# Altium schematic sheet PCB_3U_VHDCI_Baseboard.schdoc: Metlino VHDCI
size 420 x 297 mm; Author: G.K.; CompanyName: WUT; DrawnBy: G.K.; Organization: WUT ISE; Address1: Warsaw Univeristy of Technology; Address2: Nowowiejska 15/19; Revision: -; SheetNumber: -; SheetTotal: -; EDA_Number: ARTIQ; Projet: ARTIQ; ModifiedBy: -; CreateDate: XX/XX/XXXX; CheckedDate: -; Title2: Base board; DivGrp: ISE; Designer: G.K.; ModifiedDate: -; ProjectName: ARTIQ
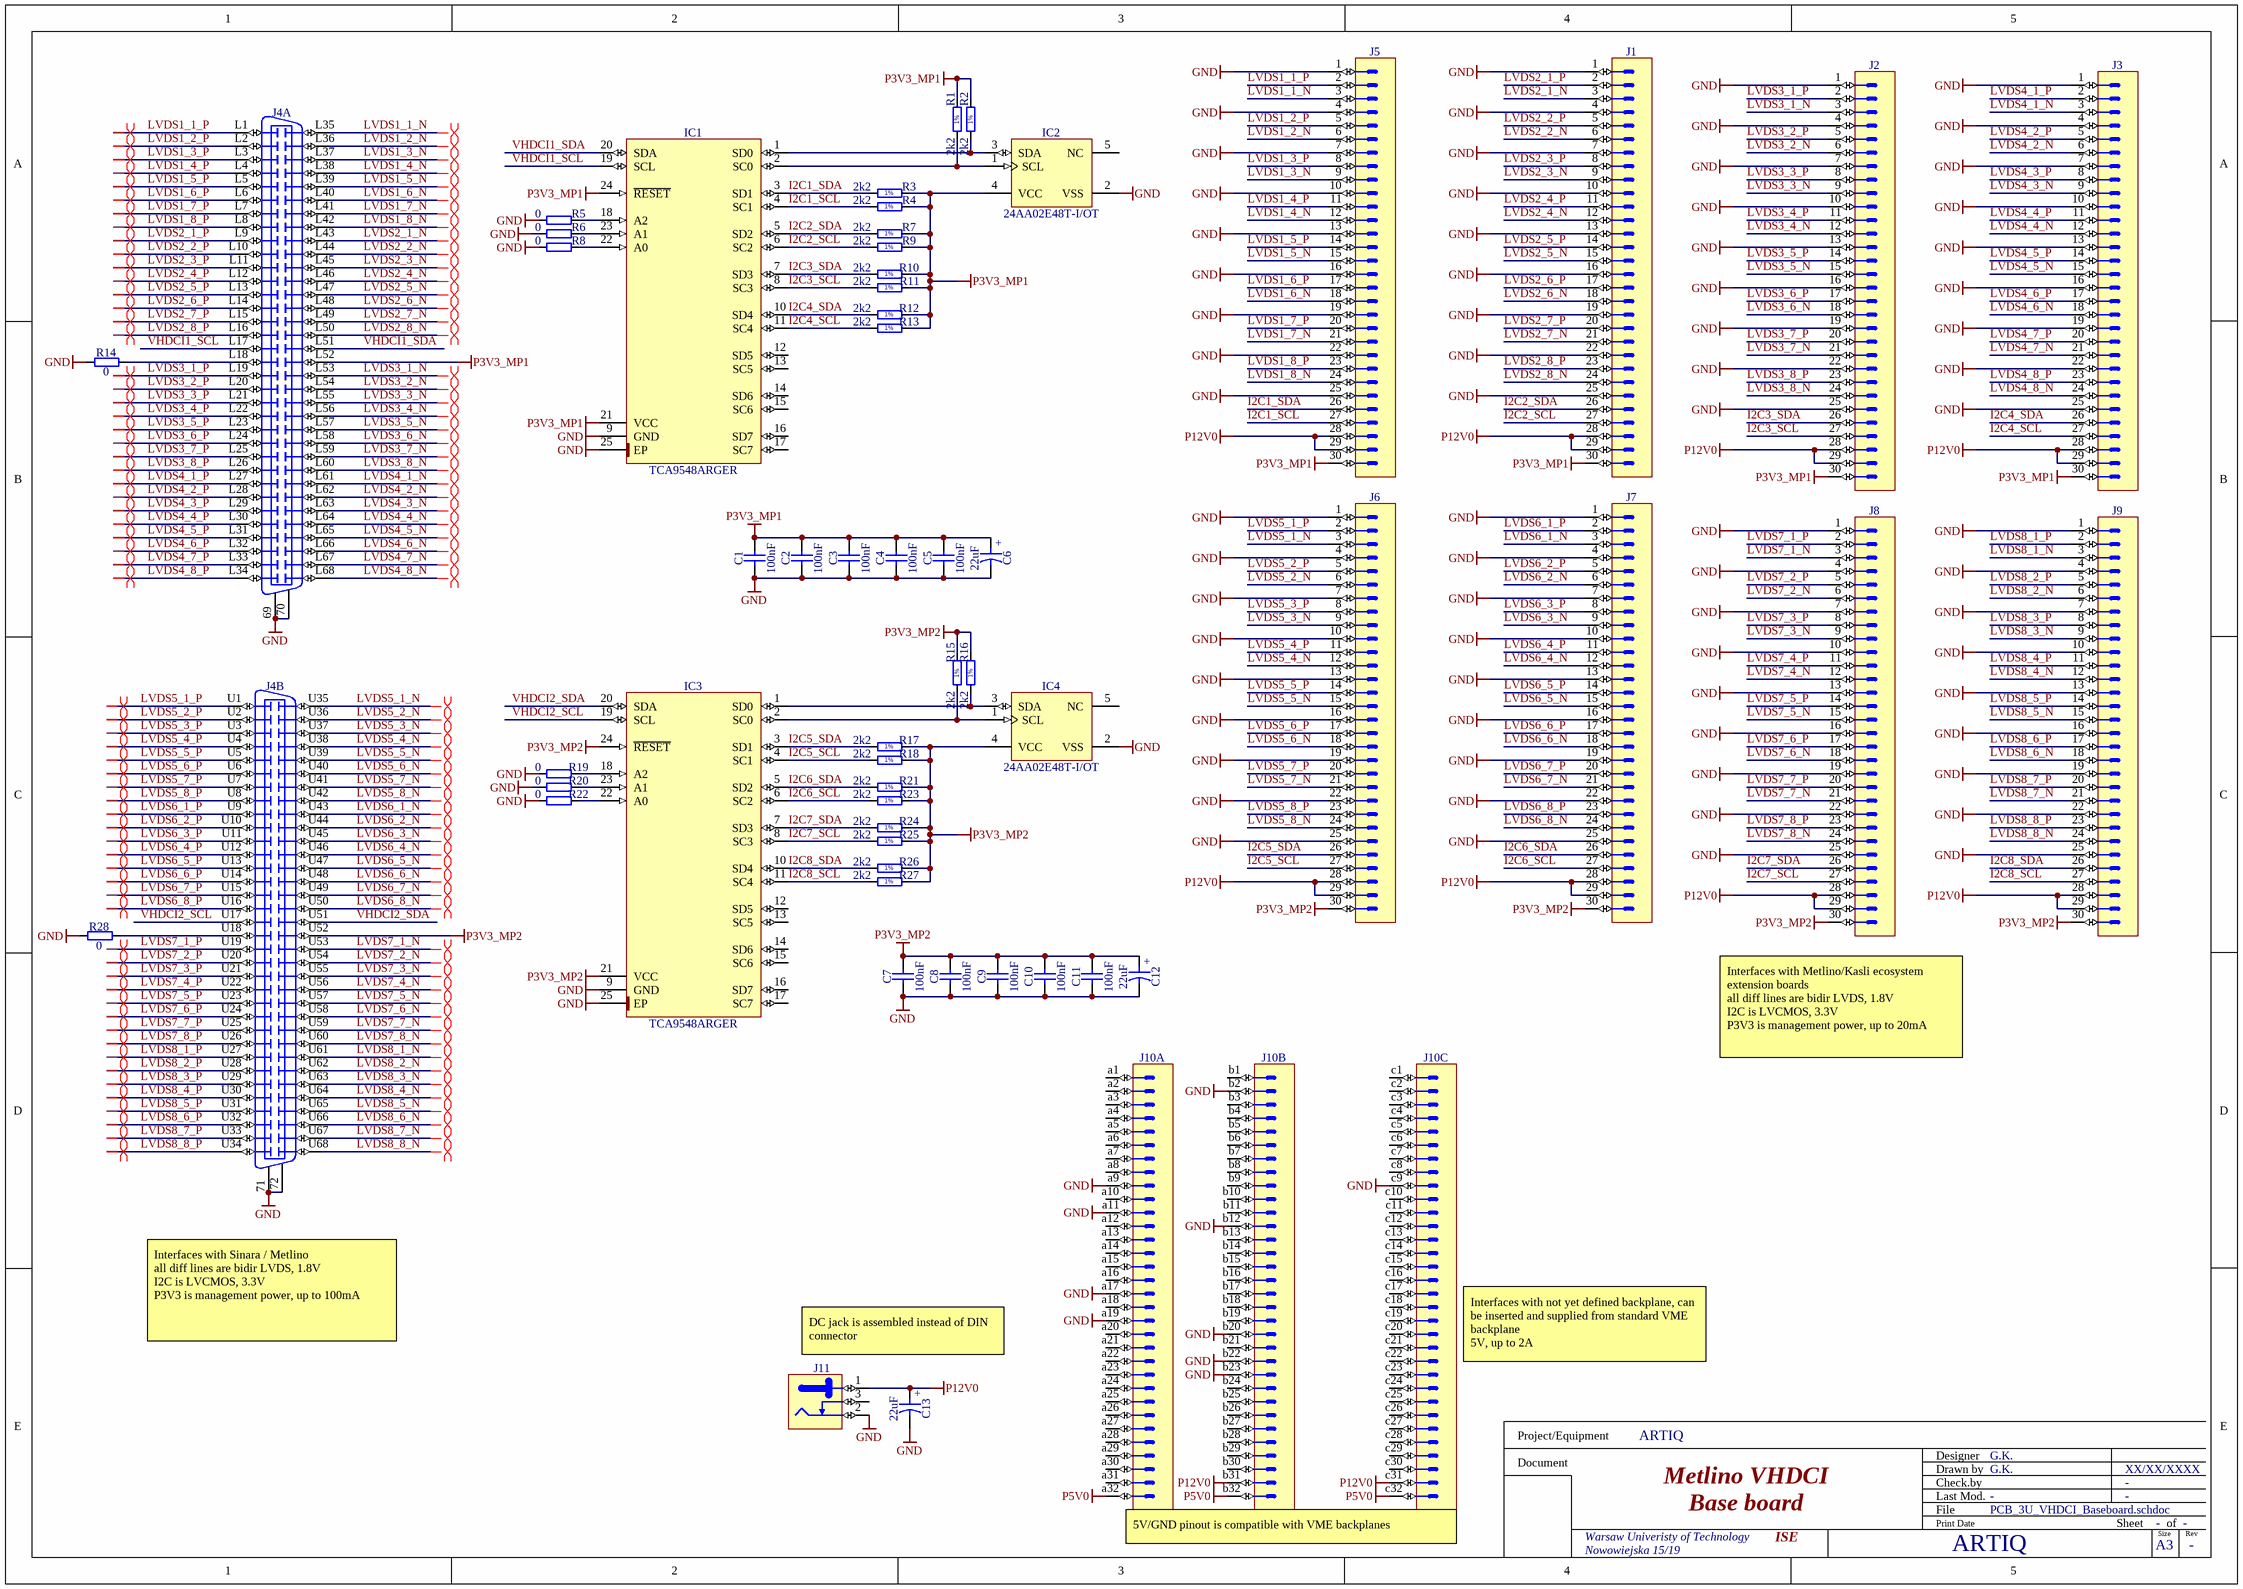
[diagram p0: PCB_3U_VHDCI_Baseboard.schdoc]

## Parts
C1  100nF  [CAPC1005X55N]
C2  100nF  [CAPC1005X55N]
C3  100nF  [CAPC1005X55N]
C4  100nF  [CAPC1005X55N]
C5  100nF  [CAPC1005X55N]
C6  22uF  [CAPAE530X540N]
C7  100nF  [CAPC1005X55N]
C8  100nF  [CAPC1005X55N]
C9  100nF  [CAPC1005X55N]
C10  100nF  [CAPC1005X55N]
C11  100nF  [CAPC1005X55N]
C12  22uF  [CAPAE530X540N]
C13  22uF  [CAPAE530X540N]
IC1  TCA9548ARGER  [QFN50P400X400X100-25N-S220]
IC2  24AA02E48T-I/OT  [SOT95P280X145-5N]
IC3  TCA9548ARGER  [QFN50P400X400X100-25N-S220]
IC4  24AA02E48T-I/OT  [SOT95P280X145-5N]
J1  (no value)  [3M_N2530-6002RB]
J2  (no value)  [3M_N2530-6002RB]
J3  (no value)  [3M_N2530-6002RB]
J4  VHDCI  [MOLEX_74337-0015]  (value not drawn)  (parts A,B of 2)
J5  (no value)  [3M_N2530-6002RB]
J6  (no value)  [3M_N2530-6002RB]
J7  (no value)  [3M_N2530-6002RB]
J8  (no value)  [3M_N2530-6002RB]
J9  (no value)  [3M_N2530-6002RB]
J10  DIN 41612 Type C  [HARTING_09 03 196 2921]  (value not drawn)  (parts A,B,C of 4)
J11  Jack  [CUI_PJ-102BH]  (value not drawn)
R1  2k2  [RESC1005X40N]
R2  2k2  [RESC1005X40N]
R3  2k2  [RESC1005X40N]
R4  2k2  [RESC1005X40N]
R5  0  [RESC1005X40N]
R6  0  [RESC1005X40N]
R7  2k2  [RESC1005X40N]
R8  0  [RESC1005X40N]
R9  2k2  [RESC1005X40N]
R10  2k2  [RESC1005X40N]
R11  2k2  [RESC1005X40N]
R12  2k2  [RESC1005X40N]
R13  2k2  [RESC1005X40N]
R14  0  [RESC1005X40N]
R15  2k2  [RESC1005X40N]
R16  2k2  [RESC1005X40N]
R17  2k2  [RESC1005X40N]
R18  2k2  [RESC1005X40N]
R19  0  [RESC1005X40N]
R20  0  [RESC1005X40N]
R21  2k2  [RESC1005X40N]
R22  0  [RESC1005X40N]
R23  2k2  [RESC1005X40N]
R24  2k2  [RESC1005X40N]
R25  2k2  [RESC1005X40N]
R26  2k2  [RESC1005X40N]
R27  2k2  [RESC1005X40N]
R28  0  [RESC1005X40N]

## Nets
GND: C1.1 C2.1 C3.1 C4.1 C5.1 C6.2 C7.1 C8.1 C9.1 C10.1 C11.1 C12.2 C13.2 IC1.9(GND) IC1.25(EP) IC2.2(VSS) IC3.9(GND) IC3.25(EP) IC4.2(VSS) J1.1 J1.4 J1.7 J1.10 J1.13 J1.16 J1.19 J1.22 J1.25 J2.1 J2.4 J2.7 J2.10 J2.13 J2.16 J2.19 J2.22 J2.25 J3.1 J3.4 J3.7 J3.10 J3.13 J3.16 J3.19 J3.22 J3.25 J4.69 J4.70 J4.71 J4.72 J5.1 J5.4 J5.7 J5.10 J5.13 J5.16 J5.19 J5.22 J5.25 J6.1 J6.4 J6.7 J6.10 J6.13 J6.16 J6.19 J6.22 J6.25 J7.1 J7.4 J7.7 J7.10 J7.13 J7.16 J7.19 J7.22 J7.25 J8.1 J8.4 J8.7 J8.10 J8.13 J8.16 J8.19 J8.22 J8.25 J9.1 J9.4 J9.7 J9.10 J9.13 J9.16 J9.19 J9.22 J9.25 J10.a9 J10.a11 J10.a17 J10.a19 J10.b2 J10.b12 J10.b20 J10.b22 J10.b23 J10.c9 J11.2 R5.1 R6.1 R8.1 R14.1 R19.1 R20.1 R22.1 R28.1
P3V3_MP1: C1.2 C2.2 C3.2 C4.2 C5.2 C6.1 IC1.21(VCC) IC1.24(~{RESET}) IC2.4(VCC) J1.30 J2.30 J3.30 J4.L52 J5.30 R1.2 R2.2 R3.2 R4.2 R7.2 R9.2 R10.2 R11.2 R12.2 R13.2
P3V3_MP2: C7.2 C8.2 C9.2 C10.2 C11.2 C12.1 IC3.21(VCC) IC3.24(~{RESET}) IC4.4(VCC) J4.U52 J6.30 J7.30 J8.30 J9.30 R15.2 R16.2 R17.2 R18.2 R21.2 R23.2 R24.2 R25.2 R26.2 R27.2
P5V0: J10.a32 J10.b32 J10.c32
P12V0: C13.1 J1.28 J1.29 J2.28 J2.29 J3.28 J3.29 J5.28 J5.29 J6.28 J6.29 J7.28 J7.29 J8.28 J8.29 J9.28 J9.29 J10.b31 J10.c31 J11.1
I2C1_SCL: IC1.4(SC1) J5.27 R4.1
I2C1_SDA: IC1.3(SD1) J5.26 R3.1
I2C2_SCL: IC1.6(SC2) J1.27 R9.1
I2C2_SDA: IC1.5(SD2) J1.26 R7.1
I2C3_SCL: IC1.8(SC3) J2.27 R11.1
I2C3_SDA: IC1.7(SD3) J2.26 R10.1
I2C4_SCL: IC1.11(SC4) J3.27 R13.1
I2C4_SDA: IC1.10(SD4) J3.26 R12.1
I2C5_SCL: IC3.4(SC1) J6.27 R18.1
I2C5_SDA: IC3.3(SD1) J6.26 R17.1
I2C6_SCL: IC3.6(SC2) J7.27 R23.1
I2C6_SDA: IC3.5(SD2) J7.26 R21.1
I2C7_SCL: IC3.8(SC3) J8.27 R25.1
I2C7_SDA: IC3.7(SD3) J8.26 R24.1
I2C8_SCL: IC3.11(SC4) J9.27 R27.1
I2C8_SDA: IC3.10(SD4) J9.26 R26.1
LVDS1_1_N: J4.L35 J5.3
LVDS1_1_P: J4.L1 J5.2
LVDS1_2_N: J4.L36 J5.6
LVDS1_2_P: J4.L2 J5.5
LVDS1_3_N: J4.L37 J5.9
LVDS1_3_P: J4.L3 J5.8
LVDS1_4_N: J4.L38 J5.12
LVDS1_4_P: J4.L4 J5.11
LVDS1_5_N: J4.L39 J5.15
LVDS1_5_P: J4.L5 J5.14
LVDS1_6_N: J4.L40 J5.18
LVDS1_6_P: J4.L6 J5.17
LVDS1_7_N: J4.L41 J5.21
LVDS1_7_P: J4.L7 J5.20
LVDS1_8_N: J4.L42 J5.24
LVDS1_8_P: J4.L8 J5.23
LVDS2_1_N: J1.3 J4.L43
LVDS2_1_P: J1.2 J4.L9
LVDS2_2_N: J1.6 J4.L44
LVDS2_2_P: J1.5 J4.L10
LVDS2_3_N: J1.9 J4.L45
LVDS2_3_P: J1.8 J4.L11
LVDS2_4_N: J1.12 J4.L46
LVDS2_4_P: J1.11 J4.L12
LVDS2_5_N: J1.15 J4.L47
LVDS2_5_P: J1.14 J4.L13
LVDS2_6_N: J1.18 J4.L48
LVDS2_6_P: J1.17 J4.L14
LVDS2_7_N: J1.21 J4.L49
LVDS2_7_P: J1.20 J4.L15
LVDS2_8_N: J1.24 J4.L50
LVDS2_8_P: J1.23 J4.L16
LVDS3_1_N: J2.3 J4.L53
LVDS3_1_P: J2.2 J4.L19
LVDS3_2_N: J2.6 J4.L54
LVDS3_2_P: J2.5 J4.L20
LVDS3_3_N: J2.9 J4.L55
LVDS3_3_P: J2.8 J4.L21
LVDS3_4_N: J2.12 J4.L56
LVDS3_4_P: J2.11 J4.L22
LVDS3_5_N: J2.15 J4.L57
LVDS3_5_P: J2.14 J4.L23
LVDS3_6_N: J2.18 J4.L58
LVDS3_6_P: J2.17 J4.L24
LVDS3_7_N: J2.21 J4.L59
LVDS3_7_P: J2.20 J4.L25
LVDS3_8_N: J2.24 J4.L60
LVDS3_8_P: J2.23 J4.L26
LVDS4_1_N: J3.3 J4.L61
LVDS4_1_P: J3.2 J4.L27
LVDS4_2_N: J3.6 J4.L62
LVDS4_2_P: J3.5 J4.L28
LVDS4_3_N: J3.9 J4.L63
LVDS4_3_P: J3.8 J4.L29
LVDS4_4_N: J3.12 J4.L64
LVDS4_4_P: J3.11 J4.L30
LVDS4_5_N: J3.15 J4.L65
LVDS4_5_P: J3.14 J4.L31
LVDS4_6_N: J3.18 J4.L66
LVDS4_6_P: J3.17 J4.L32
LVDS4_7_N: J3.21 J4.L67
LVDS4_7_P: J3.20 J4.L33
LVDS4_8_N: J3.24 J4.L68
LVDS4_8_P: J3.23 J4.L34
LVDS5_1_N: J4.U35 J6.3
LVDS5_1_P: J4.U1 J6.2
LVDS5_2_N: J4.U36 J6.6
LVDS5_2_P: J4.U2 J6.5
LVDS5_3_N: J4.U37 J6.9
LVDS5_3_P: J4.U3 J6.8
LVDS5_4_N: J4.U38 J6.12
LVDS5_4_P: J4.U4 J6.11
LVDS5_5_N: J4.U39 J6.15
LVDS5_5_P: J4.U5 J6.14
LVDS5_6_N: J4.U40 J6.18
LVDS5_6_P: J4.U6 J6.17
LVDS5_7_N: J4.U41 J6.21
LVDS5_7_P: J4.U7 J6.20
LVDS5_8_N: J4.U42 J6.24
LVDS5_8_P: J4.U8 J6.23
LVDS6_1_N: J4.U43 J7.3
LVDS6_1_P: J4.U9 J7.2
LVDS6_2_N: J4.U44 J7.6
LVDS6_2_P: J4.U10 J7.5
LVDS6_3_N: J4.U45 J7.9
LVDS6_3_P: J4.U11 J7.8
LVDS6_4_N: J4.U46 J7.12
LVDS6_4_P: J4.U12 J7.11
LVDS6_5_N: J4.U47 J7.15
LVDS6_5_P: J4.U13 J7.14
LVDS6_6_N: J4.U48 J7.18
LVDS6_6_P: J4.U14 J7.17
LVDS6_7_N: J4.U49 J7.21
LVDS6_7_P: J4.U15 J7.20
LVDS6_8_N: J4.U50 J7.24
LVDS6_8_P: J4.U16 J7.23
LVDS7_1_N: J4.U53 J8.3
LVDS7_1_P: J4.U19 J8.2
LVDS7_2_N: J4.U54 J8.6
LVDS7_2_P: J4.U20 J8.5
LVDS7_3_N: J4.U55 J8.9
LVDS7_3_P: J4.U21 J8.8
LVDS7_4_N: J4.U56 J8.12
LVDS7_4_P: J4.U22 J8.11
LVDS7_5_N: J4.U57 J8.15
LVDS7_5_P: J4.U23 J8.14
LVDS7_6_N: J4.U58 J8.18
LVDS7_6_P: J4.U24 J8.17
LVDS7_7_N: J4.U59 J8.21
LVDS7_7_P: J4.U25 J8.20
LVDS7_8_N: J4.U60 J8.24
LVDS7_8_P: J4.U26 J8.23
LVDS8_1_N: J4.U61 J9.3
LVDS8_1_P: J4.U27 J9.2
LVDS8_2_N: J4.U62 J9.6
LVDS8_2_P: J4.U28 J9.5
LVDS8_3_N: J4.U63 J9.9
LVDS8_3_P: J4.U29 J9.8
LVDS8_4_N: J4.U64 J9.12
LVDS8_4_P: J4.U30 J9.11
LVDS8_5_N: J4.U65 J9.15
LVDS8_5_P: J4.U31 J9.14
LVDS8_6_N: J4.U66 J9.18
LVDS8_6_P: J4.U32 J9.17
LVDS8_7_N: J4.U67 J9.21
LVDS8_7_P: J4.U33 J9.20
LVDS8_8_N: J4.U68 J9.24
LVDS8_8_P: J4.U34 J9.23
VHDCI1_SCL: IC1.19(SCL) J4.L17
VHDCI1_SDA: IC1.20(SDA) J4.L51
VHDCI2_SCL: IC3.19(SCL) J4.U17
VHDCI2_SDA: IC3.20(SDA) J4.U51
NetIC1_1: IC1.1(SD0) IC2.3(SDA) R2.1
NetIC1_2: IC1.2(SC0) IC2.1(SCL) R1.1
NetIC1_18: IC1.18(A2) R5.2
NetIC1_22: IC1.22(A0) R8.2
NetIC1_23: IC1.23(A1) R6.2
NetIC3_1: IC3.1(SD0) IC4.3(SDA) R16.1
NetIC3_2: IC3.2(SC0) IC4.1(SCL) R15.1
NetIC3_18: IC3.18(A2) R19.2
NetIC3_22: IC3.22(A0) R22.2
NetIC3_23: IC3.23(A1) R20.2
NetJ4_L18: J4.L18 R14.2
NetJ4_U18: J4.U18 R28.2

Not connected (* = marked no-connect by the designer): IC1 12(SD5) 13(SC5) 14(SD6) 15(SC6) 16(SD7) 17(SC7); IC2 5(NC); IC3 12(SD5) 13(SC5) 14(SD6) 15(SC6) 16(SD7) 17(SC7); IC4 5(NC); J10 a1 a2 a3 a4 a5 a6 a7 a8 a10 a12 a13 a14 a15 a16 a18 a20 a21 a22 a23 a24 a25 a26 a27 a28 a29 a30 a31 b1 b3 b4 b5 b6 b7 b8 b9 b10 b11 b13 b14 b15 b16 b17 b18 b19 b21 b24 b25 b26 b27 b28 b29 b30 c1 c2 c3 c4 c5 c6 c7 c8 c10 c11 c12 c13 c14 c15 c16 c17 c18 c19 c20 c21 c22 c23 c24 c25 c26 c27 c28 c29 c30; J11 3

## Layout directives
differential pair: LVDS1_1_N, LVDS1_1_P, LVDS1_2_N, LVDS1_2_P, LVDS1_3_N, LVDS1_3_P, LVDS1_4_N, LVDS1_4_P, LVDS1_5_N, LVDS1_5_P, LVDS1_6_N, LVDS1_6_P, LVDS1_7_N, LVDS1_7_P, LVDS1_8_N, LVDS1_8_P, LVDS2_1_N, LVDS2_1_P, LVDS2_2_N, LVDS2_2_P, LVDS2_3_N, LVDS2_3_P, LVDS2_4_N, LVDS2_4_P, LVDS2_5_N, LVDS2_5_P, LVDS2_6_N, LVDS2_6_P, LVDS2_7_N, LVDS2_7_P, LVDS2_8_N, LVDS2_8_P, LVDS3_1_N, LVDS3_1_P, LVDS3_2_N, LVDS3_2_P, LVDS3_3_N, LVDS3_3_P, LVDS3_4_N, LVDS3_4_P, LVDS3_5_N, LVDS3_5_P, LVDS3_6_N, LVDS3_6_P, LVDS3_7_N, LVDS3_7_P, LVDS3_8_N, LVDS3_8_P, LVDS4_1_N, LVDS4_1_P, LVDS4_2_N, LVDS4_2_P, LVDS4_3_N, LVDS4_3_P, LVDS4_4_N, LVDS4_4_P, LVDS4_5_N, LVDS4_5_P, LVDS4_6_N, LVDS4_6_P, LVDS4_7_N, LVDS4_7_P, LVDS4_8_N, LVDS4_8_P, LVDS5_1_N, LVDS5_1_P, LVDS5_2_N, LVDS5_2_P, LVDS5_3_N, LVDS5_3_P, LVDS5_4_N, LVDS5_4_P, LVDS5_5_N, LVDS5_5_P, LVDS5_6_N, LVDS5_6_P, LVDS5_7_N, LVDS5_7_P, LVDS5_8_N, LVDS5_8_P, LVDS6_1_N, LVDS6_1_P, LVDS6_2_N, LVDS6_2_P, LVDS6_3_N, LVDS6_3_P, LVDS6_4_N, LVDS6_4_P, LVDS6_5_N, LVDS6_5_P, LVDS6_6_N, LVDS6_6_P, LVDS6_7_N, LVDS6_7_P, LVDS6_8_N, LVDS6_8_P, LVDS7_1_N, LVDS7_1_P, LVDS7_2_N, LVDS7_2_P, LVDS7_3_N, LVDS7_3_P, LVDS7_4_N, LVDS7_4_P, LVDS7_5_N, LVDS7_5_P, LVDS7_6_N, LVDS7_6_P, LVDS7_7_N, LVDS7_7_P, LVDS7_8_N, LVDS7_8_P, LVDS8_1_N, LVDS8_1_P, LVDS8_2_N, LVDS8_2_P, LVDS8_3_N, LVDS8_3_P, LVDS8_4_N, LVDS8_4_P, LVDS8_5_N, LVDS8_5_P, LVDS8_6_N, LVDS8_6_P, LVDS8_7_N, LVDS8_7_P, LVDS8_8_N, LVDS8_8_P

## Notes on the sheet
- (near J8) Interfaces with Metlino/Kasli ecosystem extension boards
  all diff lines are bidir LVDS, 1.8V
  I2C is LVCMOS, 3.3V
  P3V3 is management power, up to 20mA
- Interfaces with Sinara / Metlino
  all diff lines are bidir LVDS, 1.8V
  I2C is LVCMOS, 3.3V
  P3V3 is management power, up to 100mA
- DC jack is assembled instead of DIN connector
- (near J10) Interfaces with not yet defined backplane, can be inserted and supplied from standard VME backplane
  5V, up to 2A
- (near J10) 5V/GND pinout is compatible with VME backplanes
- Project/Equipment
- Document
- Designer
- Drawn by
- Check.by
- File
- Last Mod.
- Print Date
- Sheet
- Size
- A3
- of
- Rev
- (in symbol CAE530-540_22UF_16V_20%) +
- (in symbol R0402_2K2_1%_0.0625W_100PPM) 1%

## Library data of the parts
C1-C5 C7-C11 = CC0402_100NF_16V_10%_X5R: Non-polarised capacitor; Part Description: SMD Multilayer Chip Ceramic Capacitor; Manufacturer: GENERIC; Manufacturer1 Part Number: GRM155R61C104KA88D; Voltage: 16V; TC: X5R; Tolerance: ±10%; Part Number: CC0402_100NF_16V_10%_X5R; Component Kind: Standard; Component Type: Standard; Pin Count: 2; Value: 100nF; Status: None; Manufacturer Part Number: CC0402_100NF_16V_10%_X5R; Case: 0402; Mounted: Yes; Socket: No; SMD: Yes; Sense: No; Manufacturer1 Example: MURATA; Manufacturer1 ComponentHeight: 0.55mm; HelpURL: \\cern.ch\dfs\Applications\Altium\Datasheets\CC0402_X5R_MURATA_GRM.pdf; Author: CERN DEM JLC; CreateDate: 10.12.2013; LatestRevisionDate: 10.12.2013
C6 C12 C13 = CAE530-540_22UF_16V_20%: Polarised capacitor; Part Description: Aluminum Electrolytic SMT Capacitor; Manufacturer: PANASONIC; Manufacturer Part Number: EEEFK1C220AR; Voltage: 16V; Tolerance: ±20%; Part Number: CAE530-540_22UF_16V_20%; Component Kind: Standard; Component Type: Standard; Pin Count: 2; Value: 22uF; Status: Not Recommended; Case: B; Mounted: Yes; Socket: No; SMD: Yes; Sense: No; HelpURL: \\cern.ch\dfs\Applications\Altium\Datasheets\CAE_PANASONIC_FK.pdf; Author: CERN DEM JLC; CreateDate: 03.12.2007; LatestRevisionDate: 05.11.2014; ComponentHeight: 5.8mm
IC1 IC3 = TCA9548ARGER: Low Voltage 8-Channel I2C Switch With Reset; Manufacturer: TEXAS INSTRUMENTS; PressFit: No; Bonding: No; Part Number: TCA9548ARGER; Component Kind: Standard; Component Type: Standard; Device: TCA9548ARGER; PackageDescription: QFN, 0.50mm Pitch, Square; 24 Pin, 4.00mm L X 4.00mm W X 1.00mm H body (w/thermal tab 2.2 X 2.2mm), IPC Medium Density; Part Description: Low Voltage 8-Channel I2C Switch With Reset; Manufacturer Part Number: TCA9548ARGER; Pin Count: 25; Case: QFN24; Mounted: Yes; Socket: No; SMD: Yes; Sense: No; ComponentHeight: 1mm; Author: CERN DEM JLC; HelpURL: \\cern.ch\dfs\Applications\Altium\Datasheets\TCA9548ARGER.pdf; CreateDate: 07.07.2014; LatestRevisionDate: 07.07.2014
IC2 IC4 = 24AA02E48T-I/OT: 1.7V-5.5V, 2K I2C Serial EEPROM With EUI-48 Node Identity; Manufacturer: MICROCHIP TECHNOLOGY; PressFit: No; Bonding: No; Part Number: 24AA02E48T-I/OT; Component Kind: Standard; Component Type: Standard; Device: 24AA02E48T-I/OT; PackageDescription: SOT, 0.95mm pitch; 5 pin, 1.60mm W X 2.90mm L X 1.45mm H body, IPC Medium Density; Part Description: 1.7V-5.5V, 2K I2C Serial EEPROM With EUI-48 Node Identity; Manufacturer Part Number: 24AA02E48T-I/OT; Pin Count: 5; Case: SOT23-5; Mounted: Yes; Socket: No; SMD: Yes; Sense: No; ComponentHeight: 1.45mm; HelpURL: \\cern.ch\dfs\Applications\Altium\Datasheets\24AA02E48T-I-OT.pdf; Author: CERN DEM MR; CreateDate: 31.03.2016; LatestRevisionDate: 31.03.2016
J1-J3 J5-J9 = 3M_N2530-6002RB: Connector 30 Male; Part Description: 30 Contacts - Straight .100'' x .100'' Low Profile Four-Wall Header, 2500 Series; Manufacturer: 3M; PressFit: No; Part Number: 3M_N2530-6002RB; Component Kind: Standard; Component Type: Standard; Pin Count: 30; Family: Header 30; Mounted: Yes; Socket: No; SMD: No; Sense: No; Status: None; Manufacturer Part Number: N2530-6002RB; ComponentHeight: 10.03mm; HelpURL: \\cern.ch\dfs\Applications\Altium\Datasheets\3M_N2530-6002RB.pdf; Author: CERN DEM JLC; CreateDate: 11.02.2009; LatestRevisionDate: 11.08.2009
J4 = MOLEX_74337-0015: Very High Density Cable Interconnect (VHDCI ) 2x68 Female; Part Description: 2x68 Positions, Pitch 0.8mm, Very Hight Density Right Angle Dual Stacked VHDCI Receptacle; Manufacturer: MOLEX; PressFit: No; Part Number: MOLEX_74337-0015; Component Kind: Standard; Component Type: Standard; Pin Count: 140; Family: VHDCI; Mounted: Yes; Socket: No; SMD: No; Sense: No; Status: None; Manufacturer Part Number: 74337-0015; ComponentHeight: 10.78mm; HelpURL: \\cern.ch\dfs\Applications\Altium\Datasheets\MOLEX_74337-0015.pdf; Author: CERN DEM JLC; CreateDate: 30.04.2014; LatestRevisionDate: 30.04.2014
J10 = HARTING_09 03 196 2921: Connector 96abc male (3x32); Part Description: DIN 41612, Type C, 96 Position, Rows a+b+c, Performance level 1, Right Angle Male Connector, Lead 3.0 mm, Pitch 2.54mm; PressFit: No; Part Number: HARTING_09 03 196 2921; Component Kind: Standard; Component Type: Standard; Pin Count: 98; Family: DIN 41612 Type C; Mounted: Yes; Socket: No; SMD: No; Sense: No; Status: None; Manufacturer: HARTING; Manufacturer Part Number: 09 03 196 2921; ComponentHeight: 11mm; HelpURL: \\cern.ch\dfs\Applications\Altium\Datasheets\HARTING_09 03 196 2921.pdf; Author: CERN DEM JLC; CreateDate: 16.04.2008; LatestRevisionDate: 25.02.2013
J11 = CUI_PJ-102BH: 2.5 mm Center Pin, 5A, 24V Right Angle, Through Hole, Tapered Pins, DC Power Jack Connector; Part Description: 2.5 mm Center Pin, 5A, 24V, Right Angle, Through Hole, Tapered Pins, DC Power Jack Connector; Manufacturer: CUI INC.; PressFit: No; Part Number: CUI_PJ-102BH; Component Kind: Standard; Component Type: Standard; Pin Count: 3; Family: Jack; Mounted: Yes; Socket: No; SMD: No; Sense: No; Status: None; Manufacturer Part Number: PJ-102BH; ComponentHeight: 11mm; HelpURL: \\cern.ch\dfs\Applications\Altium\Datasheets\CUI_PJ-102BH.pdf; Author: CERN DEM JLC; CreateDate: 14.08.2013; LatestRevisionDate: 14.08.2013
R1-R4 R7 R9-R13 R15-R18 R21 R23-R27 = R0402_2K2_1%_0.0625W_100PPM: Resistor - 1%; Part Description: General Purpose Thick Film Chip Resistor; Manufacturer: GENERIC; Manufacturer1 Part Number: 232270672202L; TC: ±100ppm/°C; Part Number: R0402_2K2_1%_0.0625W_100PPM; Component Kind: Standard; Component Type: Standard; Pin Count: 2; Value: 2k2; Status: Not recommended; Power: 0.0625W; Tolerance: ±1%; Manufacturer Part Number: R0402_2K2_1%_0.0625W_100PPM; Case: 0402; Mounted: Yes; Sense: No; Socket: No; SMD: Yes; Manufacturer1 Example: YAGEO PHYCOMP; Manufacturer1 ComponentHeight: 0.4mm; HelpURL: \\cern.ch\dfs\Applications\Altium\Datasheets\R0402_Phycomp_RC0402.pdf; Author: CERN DEM JLC; CreateDate: 03.12.2007; LatestRevisionDate: 17.10.2012
R5 R6 R8 R14 R19 R20 R22 R28 = R0402_0R_JUMPER: Resistor; Part Description: 1A (0.05R Max DC Resistance) Zero Ohm Jumper; Manufacturer: GENERIC; Manufacturer1 Part Number: 232270591001L; Part Number: R0402_0R_JUMPER; Component Kind: Standard; Component Type: Standard; Pin Count: 2; Value: 0; Status: Not recommended; Manufacturer Part Number: R0402_0R_JUMPER; Case: 0402; Mounted: Yes; Sense: No; Socket: No; SMD: Yes; Manufacturer1 Example: YAGEO PHYCOMP; Manufacturer1 ComponentHeight: 0.4mm; HelpURL: \\cern.ch\dfs\Applications\Altium\Datasheets\R0402_Phycomp_RC0402.pdf; Author: CERN DEM JLC; CreateDate: 03.12.2007; LatestRevisionDate: 17.10.2012